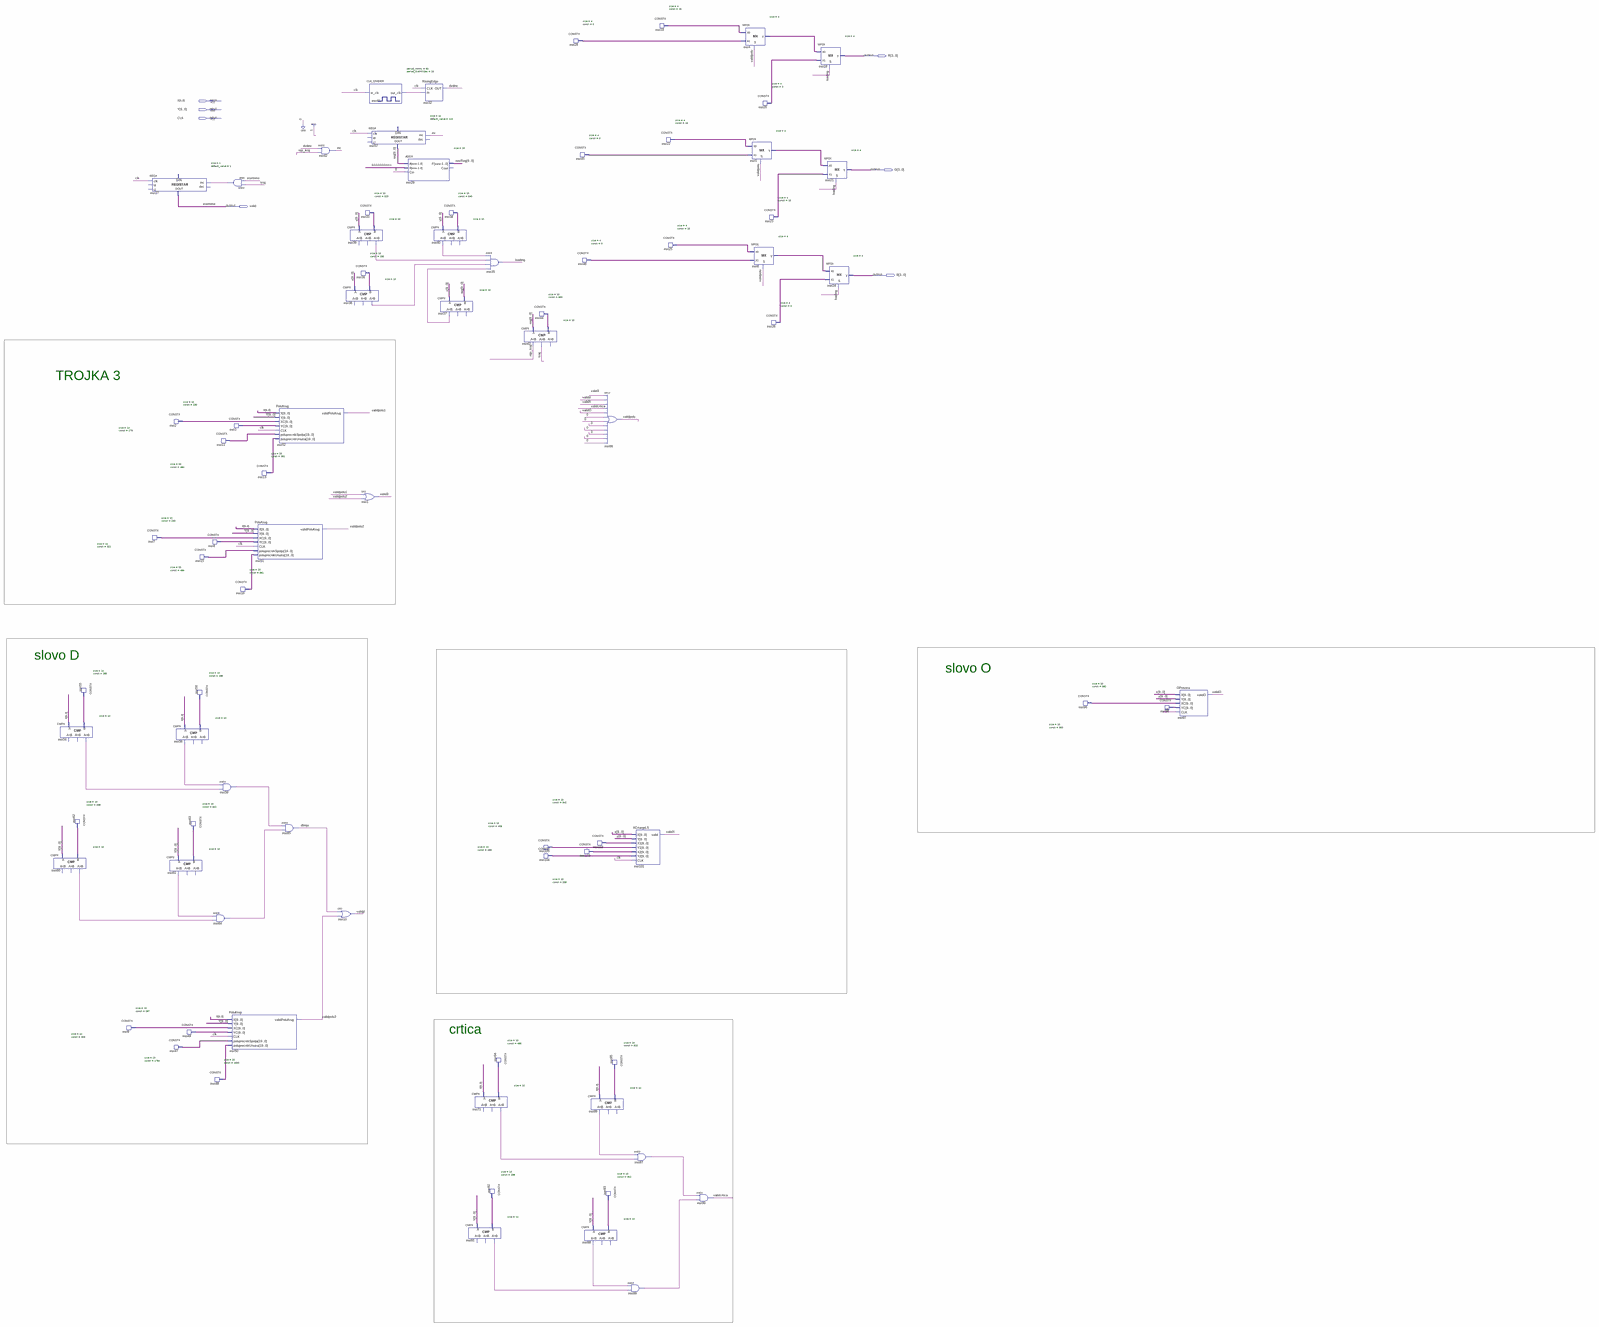
[diagram p0: schematic sheet, whole]
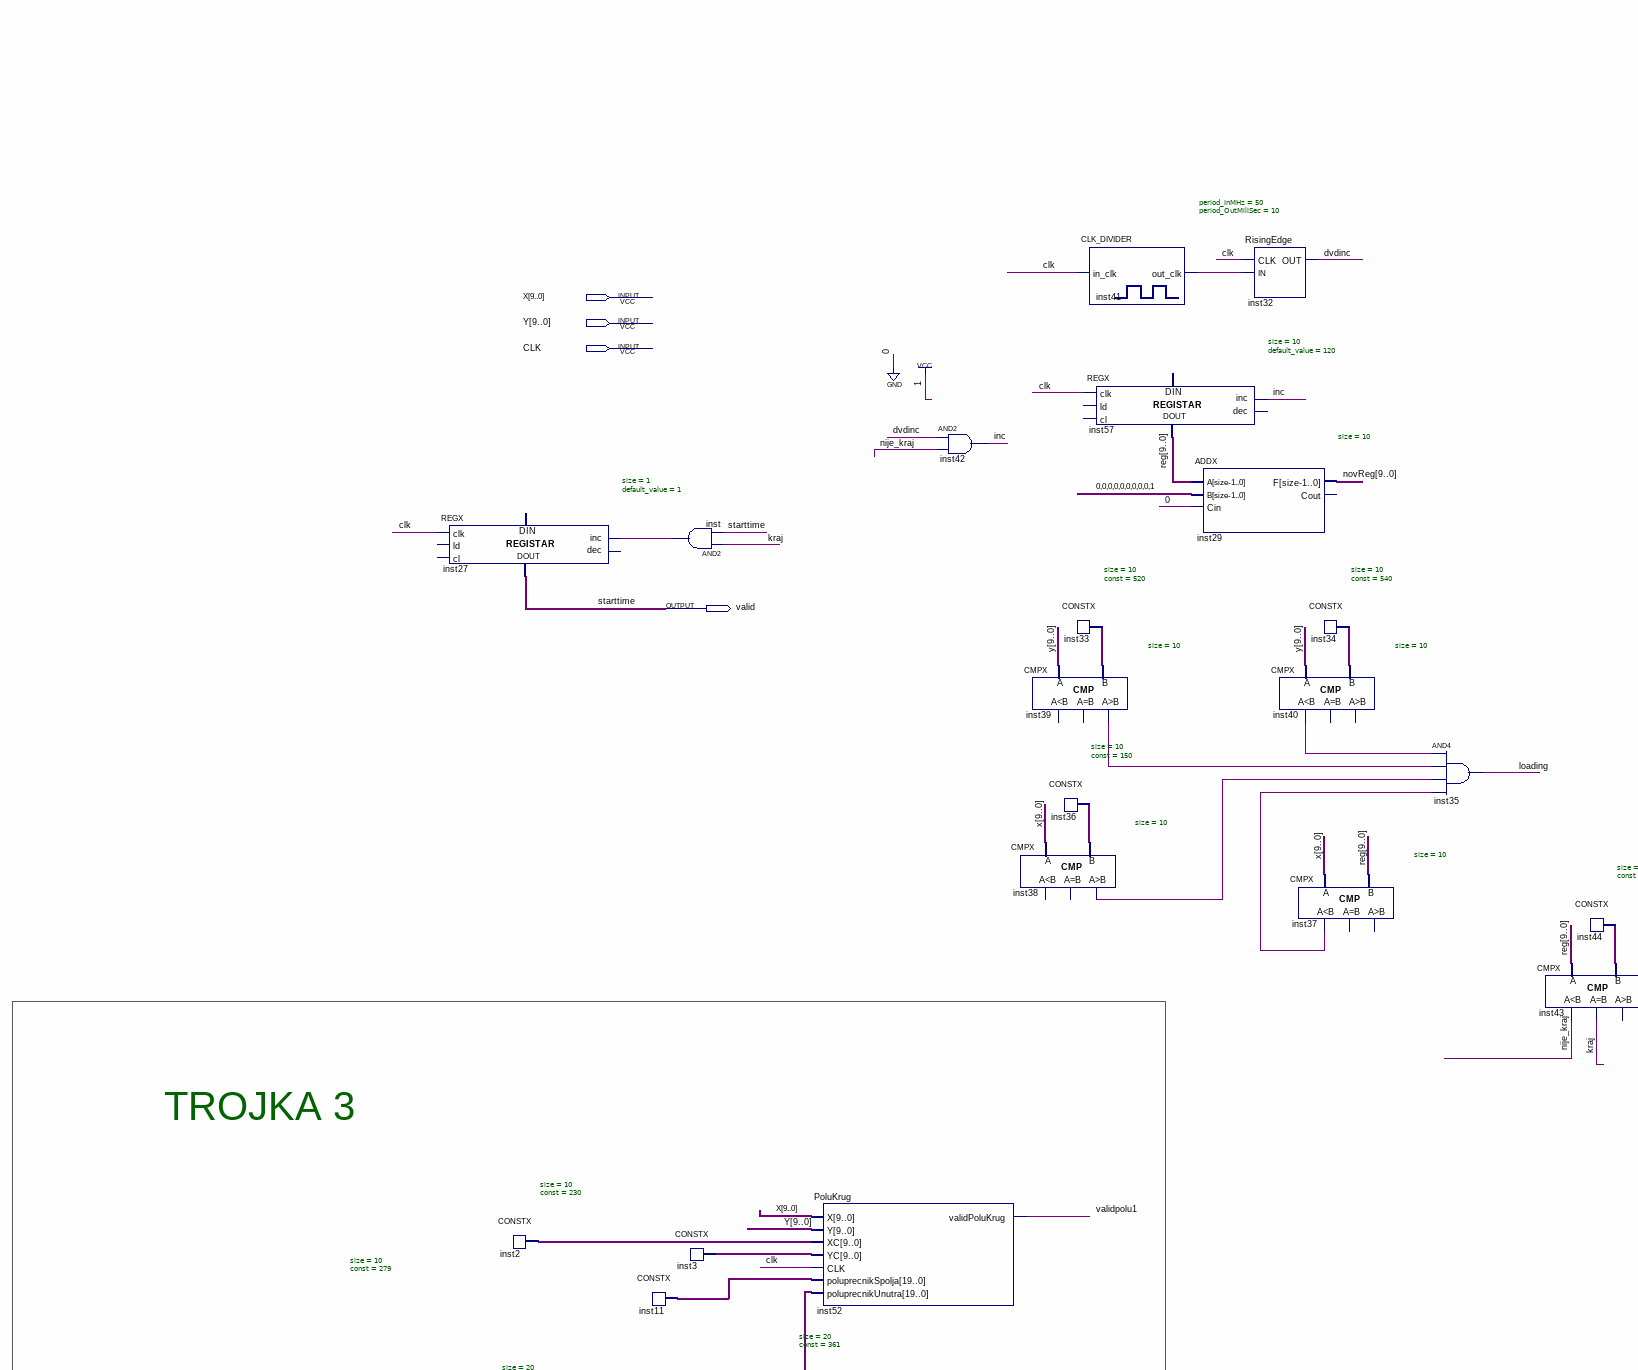
[diagram p1: schematic sheet, upper left part]
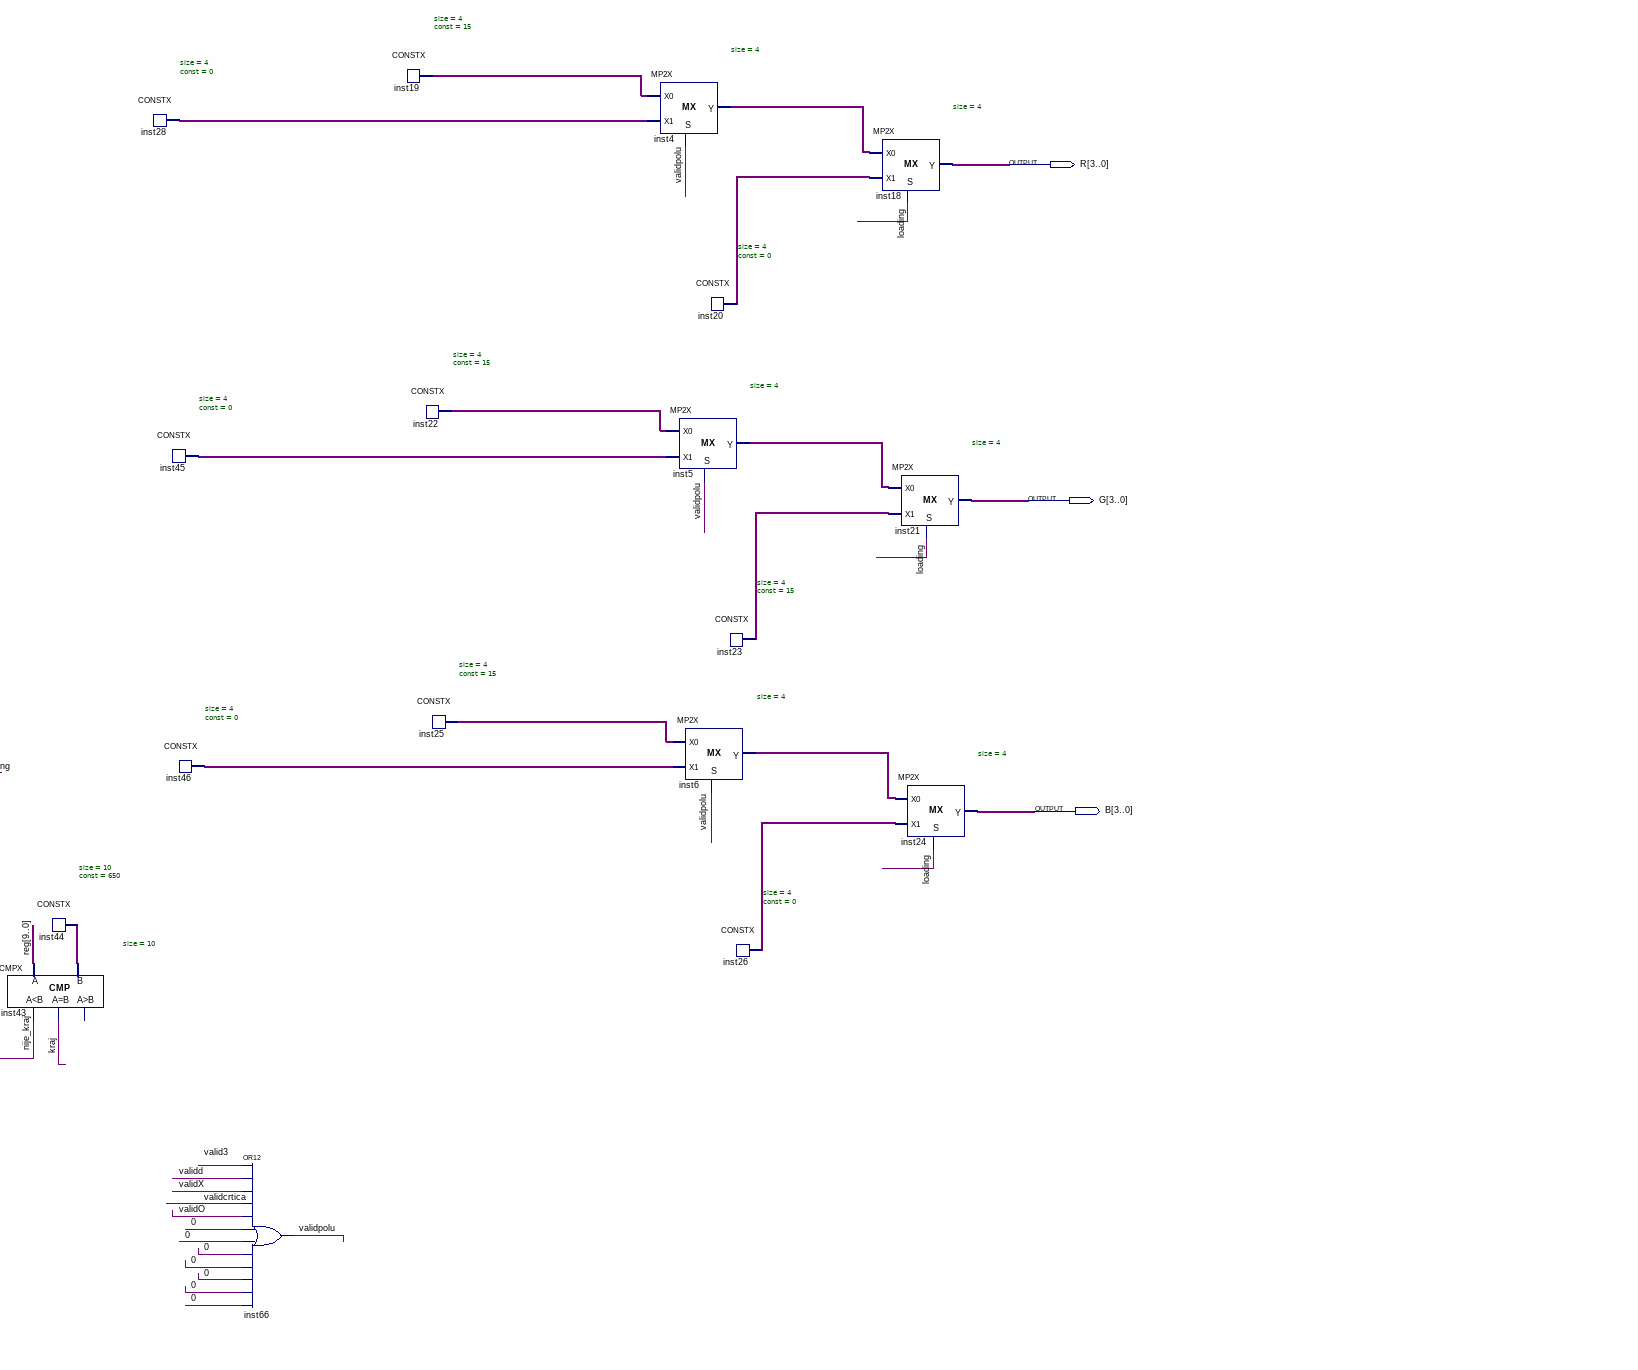
[diagram p2: schematic sheet, upper centre part]
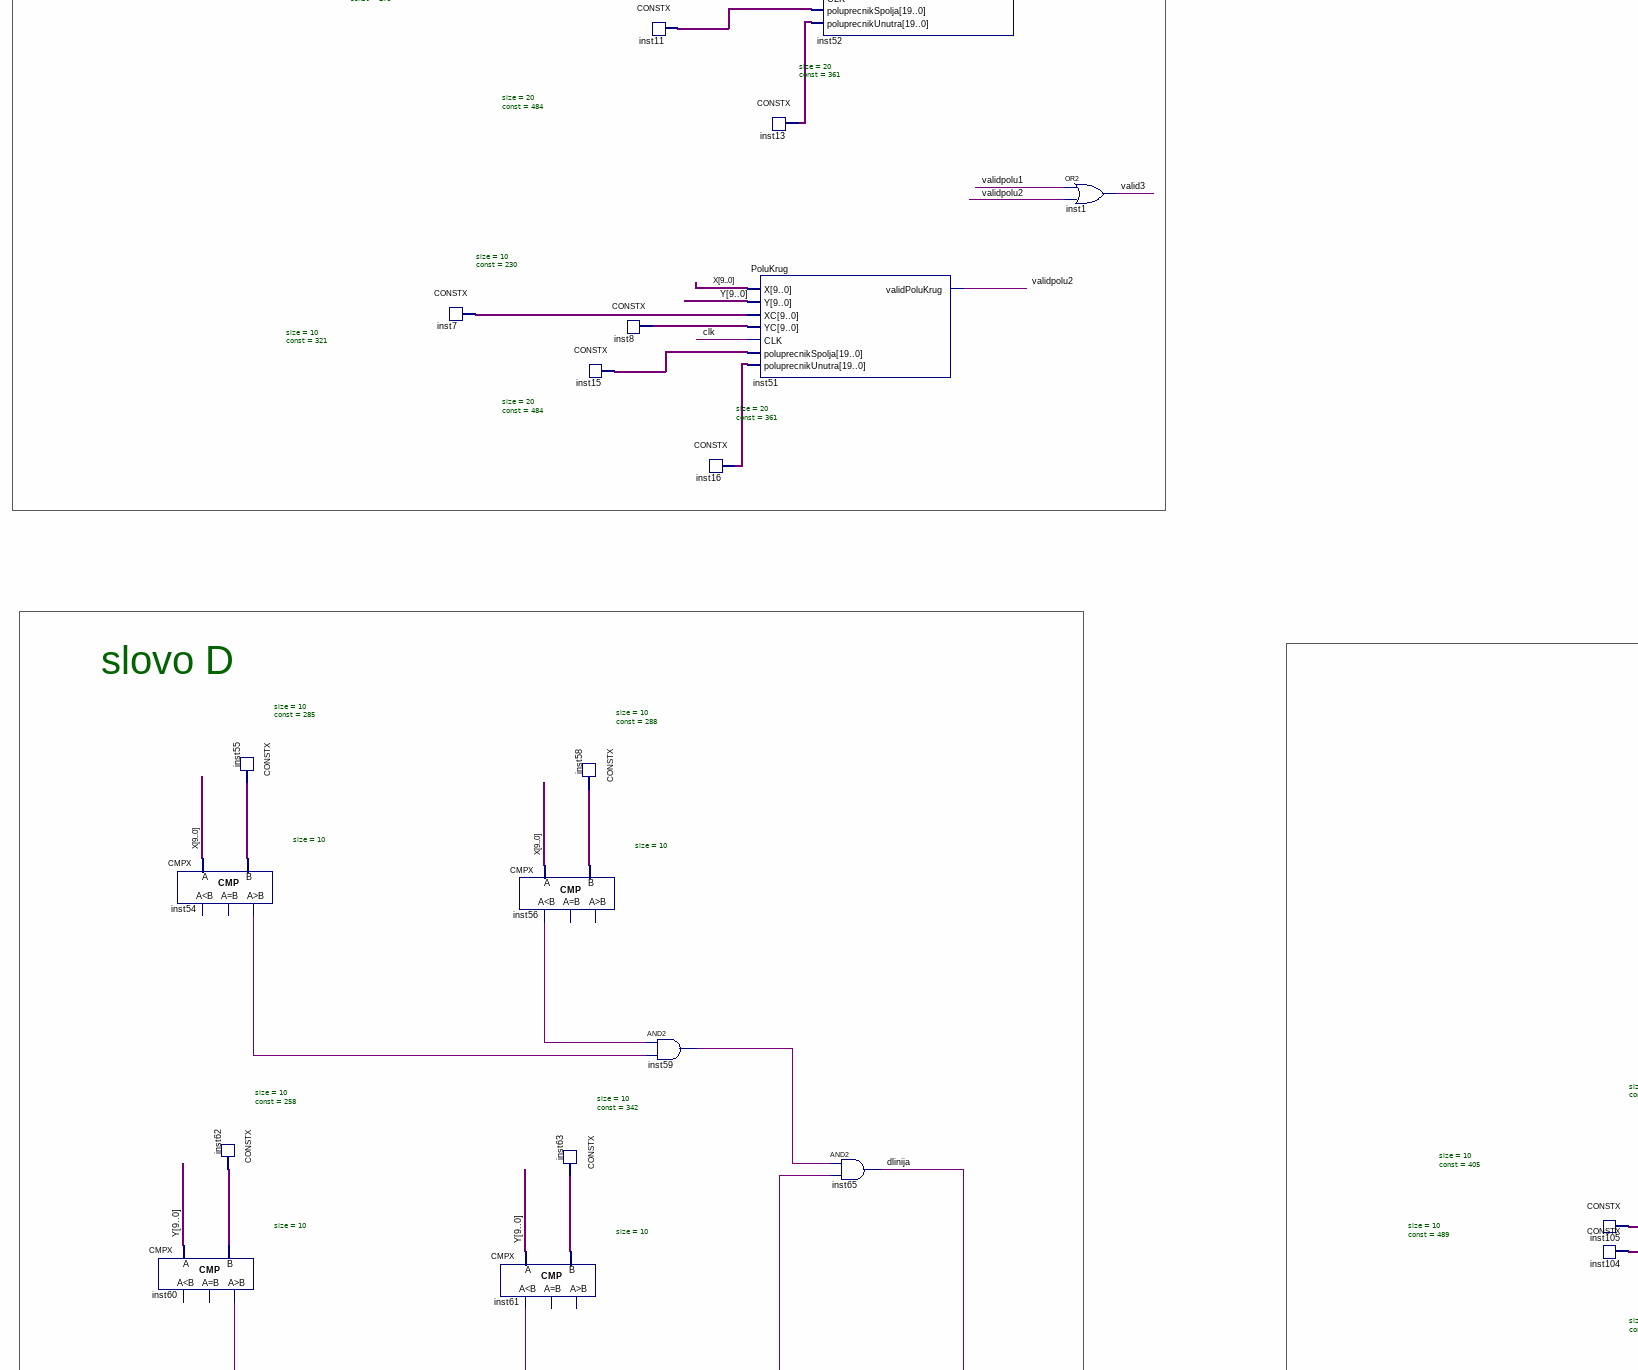
[diagram p3: schematic sheet, middle left part]
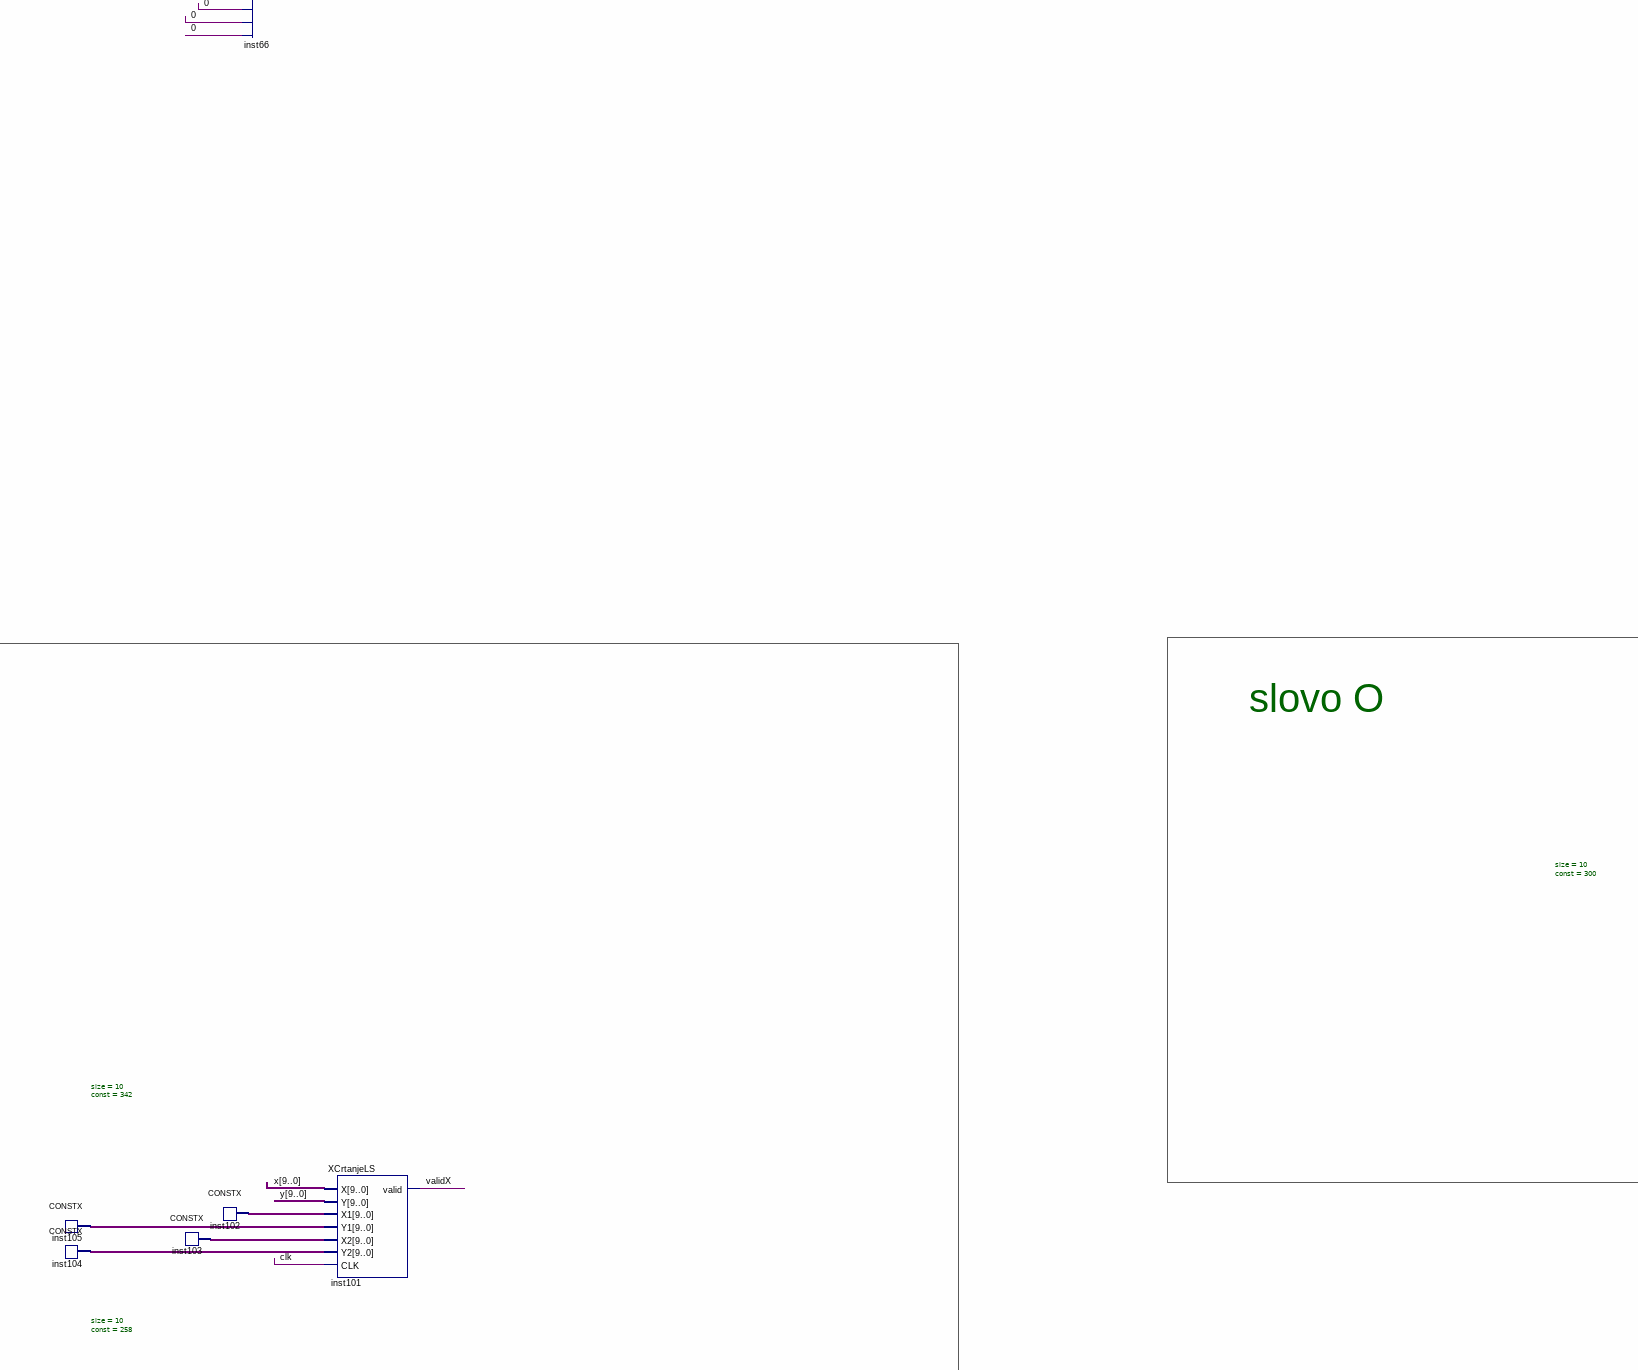
[diagram p4: schematic sheet, middle centre part]
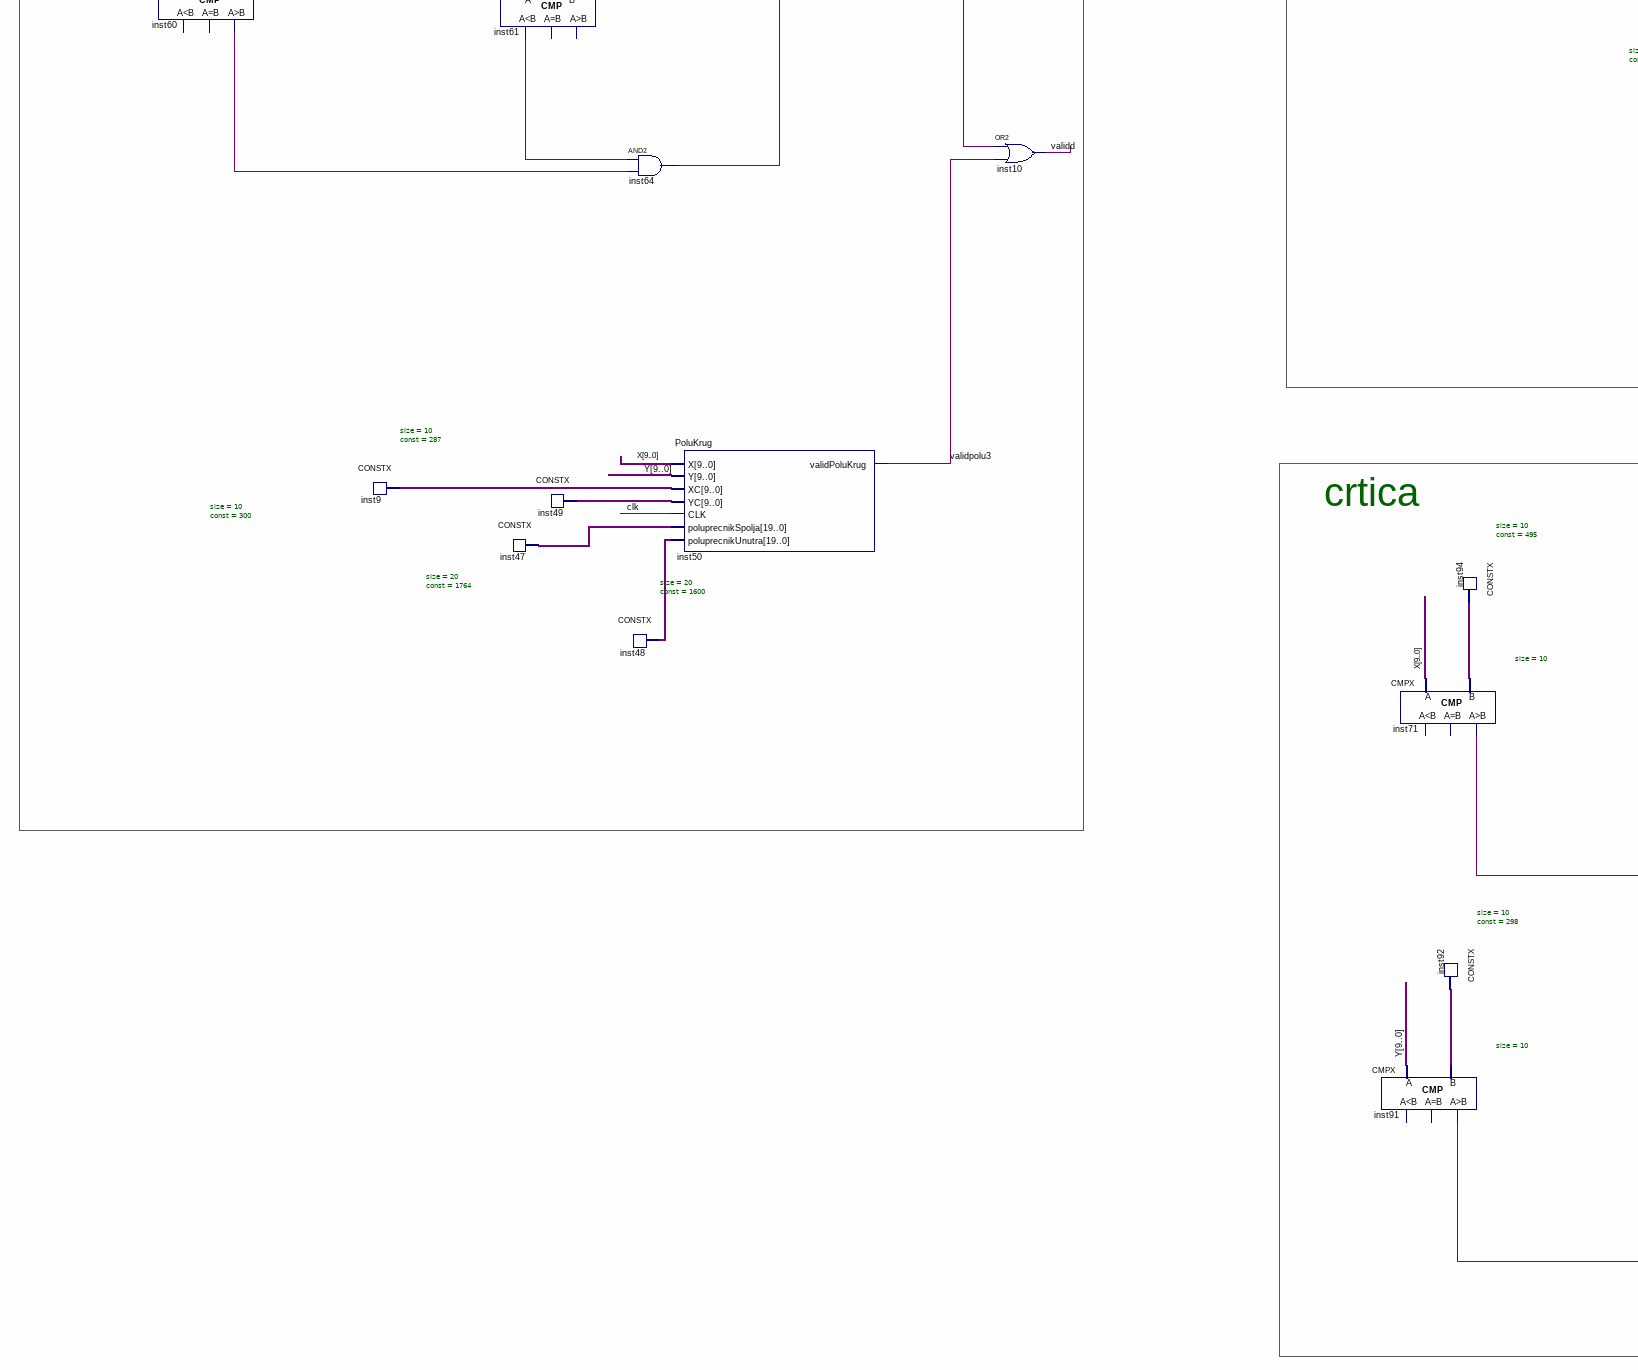
[diagram p5: schematic sheet, lower left part]
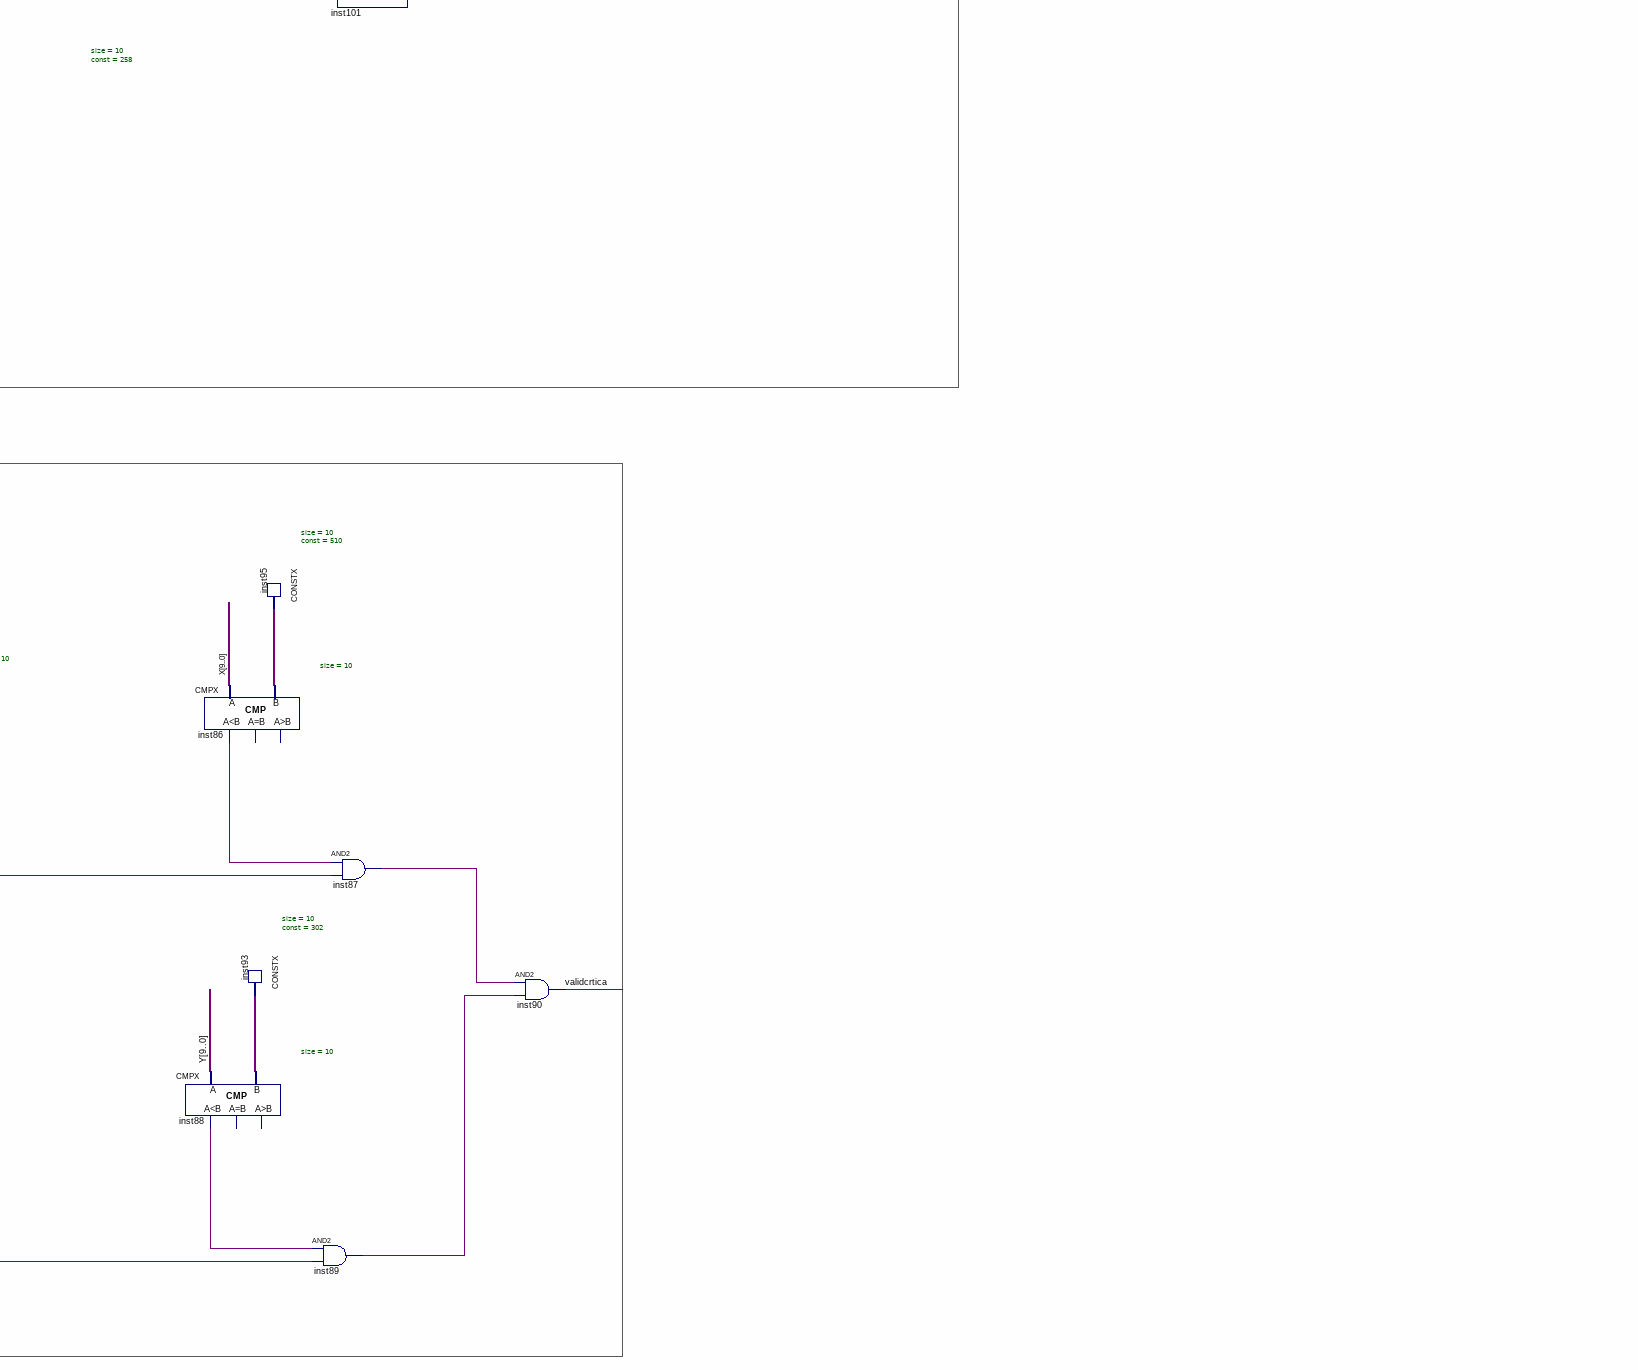
[diagram p6: schematic sheet, lower centre part]
// Quartus schematic LoadingScreen.bdf as structural Verilog: 80 symbols, 7 pins
module LoadingScreen (
  input  [9:0] X,
  input  [9:0] Y,
  input  CLK,
  output [3:0] R,
  output [3:0] G,
  output valid,
  output [3:0] B
);

  wire dlinija, dvdinc, inc, inst37_ls, inst38_gr, inst39_gr, inst40_ls, inst41_out_clk, inst54_gr,
       inst56_ls, inst59_out, inst60_gr, inst61_ls, inst64_out, inst71_gr, inst86_ls, inst87_out, inst88_ls,
       inst89_out, inst91_gr, inst_out, kraj, loading, nije_kraj, valid3, validcrtica, validd, validO,
       validpolu, validpolu1, validpolu2, validpolu3, validX;
  wire [3:0] inst4_y, inst5_y, inst6_y, inst19_data, inst20_data, inst22_data, inst23_data, inst25_data,
       inst26_data, inst28_data, inst45_data, inst46_data;
  wire [9:0] inst2_data, inst3_data, inst7_data, inst8_data, inst9_data, inst33_data, inst34_data,
       inst36_data, inst44_data, inst49_data, inst55_data, inst58_data, inst62_data, inst63_data,
       inst92_data, inst93_data, inst94_data, inst95_data, inst96_data, inst98_data, inst102_data,
       inst103_data, inst104_data, inst105_data, novReg, \reg ;
  wire [19:0] inst11_data, inst13_data, inst15_data, inst16_data, inst47_data, inst48_data;

  CMPX #(.size(10)) inst60 (.A(Y), .B(inst62_data), .gr(inst60_gr));  // open: ls, eq
  CMPX #(.size(10)) inst54 (.A(X), .B(inst55_data), .gr(inst54_gr));  // open: ls, eq
  CONSTX #(.size(10), .\const (285)) inst55 (.data(inst55_data));
  CONSTX #(.size(10), .\const (258)) inst62 (.data(inst62_data));
  CONSTX #(.size(10), .\const (287)) inst9 (.data(inst9_data));
  REGX #(.size(1), .default_value(1)) inst27 (
    .clk(CLK), .inc(inst_out), .data_out(valid));  // open: ld, cl, dec, data_in
  CONSTX #(.size(10), .\const (230)) inst7 (.data(inst7_data));
  CONSTX #(.size(10), .\const (230)) inst2 (.data(inst2_data));
  CMPX #(.size(10)) inst56 (.A(X), .B(inst58_data), .ls(inst56_ls));  // open: eq, gr
  CMPX #(.size(10)) inst61 (.A(Y), .B(inst63_data), .ls(inst61_ls));  // open: eq, gr
  CONSTX #(.size(20), .\const (1764)) inst47 (.data(inst47_data));
  CONSTX #(.size(10), .\const (342)) inst63 (.data(inst63_data));
  CONSTX #(.size(10), .\const (300)) inst49 (.data(inst49_data));
  CONSTX #(.size(10), .\const (321)) inst8 (.data(inst8_data));
  CONSTX #(.size(20), .\const (484)) inst15 (.data(inst15_data));
  CONSTX #(.size(10), .\const (288)) inst58 (.data(inst58_data));
  CONSTX #(.size(20), .\const (484)) inst11 (.data(inst11_data));
  and inst59 (inst59_out, inst56_ls, inst54_gr);
  and inst64 (inst64_out, inst61_ls, inst60_gr);
  CONSTX #(.size(20), .\const (1600)) inst48 (.data(inst48_data));
  and inst (inst_out, kraj, valid);
  CONSTX #(.size(10), .\const (279)) inst3 (.data(inst3_data));
  CONSTX #(.size(20), .\const (361)) inst16 (.data(inst16_data));
  PoluKrug inst50 (
    .X(X), .Y(Y), .XC(inst9_data), .YC(inst49_data), .CLK(CLK), .poluprecnikSpolja(inst47_data),
    .poluprecnikUnutra(inst48_data), .validPoluKrug(validpolu3));
  CONSTX #(.size(20), .\const (361)) inst13 (.data(inst13_data));
  PoluKrug inst51 (
    .X(X), .Y(Y), .XC(inst7_data), .YC(inst8_data), .CLK(CLK), .poluprecnikSpolja(inst15_data),
    .poluprecnikUnutra(inst16_data), .validPoluKrug(validpolu2));
  PoluKrug inst52 (
    .X(X), .Y(Y), .XC(inst2_data), .YC(inst3_data), .CLK(CLK), .poluprecnikSpolja(inst11_data),
    .poluprecnikUnutra(inst13_data), .validPoluKrug(validpolu1));
  and inst65 (dlinija, inst59_out, inst64_out);
  and inst42 (inc, dvdinc, nije_kraj);
  CMPX #(.size(10)) inst38 (.A(X), .B(inst36_data), .gr(inst38_gr));  // open: ls, eq
  or inst10 (validd, dlinija, validpolu3);
  CONSTX #(.size(10), .\const (520)) inst33 (.data(inst33_data));
  CMPX #(.size(10)) inst39 (.A(Y), .B(inst33_data), .gr(inst39_gr));  // open: ls, eq
  CONSTX #(.size(10), .\const (150)) inst36 (.data(inst36_data));
  or inst1 (valid3, validpolu1, validpolu2);
  CLK_DIVIDER #(.period_InMHz(50), .period_OutMiliSec(10)) inst41 (.in_clk(CLK), .out_clk(inst41_out_clk));
  REGX #(.size(10), .default_value(120)) inst57 (.clk(CLK), .inc(inc), .data_out(\reg ));  // open: ld, cl, dec, data_in
  ADDX #(.size(10)) inst29 (.A(\reg ), .B(10'b0000000001), .Cin(1'b0), .F(novReg));  // open: Cout
  RisingEdge inst32 (.CLK(CLK), .IN(inst41_out_clk), .OUT(dvdinc));
  CMPX #(.size(10)) inst40 (.A(Y), .B(inst34_data), .ls(inst40_ls));  // open: eq, gr
  CONSTX #(.size(10), .\const (540)) inst34 (.data(inst34_data));
  CMPX #(.size(10)) inst37 (.A(X), .B(\reg ), .ls(inst37_ls));  // open: eq, gr
  CMPX #(.size(10)) inst91 (.A(Y), .B(inst92_data), .gr(inst91_gr));  // open: ls, eq
  CMPX #(.size(10)) inst71 (.A(X), .B(inst94_data), .gr(inst71_gr));  // open: ls, eq
  and inst35 (loading, inst40_ls, inst39_gr, inst38_gr, inst37_ls);
  CONSTX #(.size(10), .\const (495)) inst94 (.data(inst94_data));
  CONSTX #(.size(10), .\const (298)) inst92 (.data(inst92_data));
  CONSTX #(.size(10), .\const (650)) inst44 (.data(inst44_data));
  CMPX #(.size(10)) inst43 (.A(\reg ), .B(inst44_data), .ls(nije_kraj), .eq(kraj));  // open: gr
  CONSTX #(.size(10), .\const (258)) inst105 (.data(inst105_data));
  CONSTX #(.size(10), .\const (342)) inst104 (.data(inst104_data));
  CONSTX #(.size(4), .\const (0)) inst28 (.data(inst28_data));
  CONSTX #(.size(4), .\const (0)) inst45 (.data(inst45_data));
  CONSTX #(.size(4), .\const (0)) inst46 (.data(inst46_data));
  CONSTX #(.size(10), .\const (489)) inst103 (.data(inst103_data));
  CMPX #(.size(10)) inst88 (.A(Y), .B(inst93_data), .ls(inst88_ls));  // open: eq, gr
  CONSTX #(.size(10), .\const (405)) inst102 (.data(inst102_data));
  CMPX #(.size(10)) inst86 (.A(X), .B(inst95_data), .ls(inst86_ls));  // open: eq, gr
  CONSTX #(.size(10), .\const (302)) inst93 (.data(inst93_data));
  or inst66 (validpolu, valid3, validd, validX, validcrtica, validO, 1'b0, 1'b0, 1'b0, 1'b0, 1'b0, 1'b0, 1'b0);
  CONSTX #(.size(10), .\const (510)) inst95 (.data(inst95_data));
  XCrtanjeLS inst101 (
    .X(X), .Y(Y), .X1(inst102_data), .Y1(inst105_data), .X2(inst103_data), .Y2(inst104_data), .CLK(CLK),
    .valid(validX));
  and inst87 (inst87_out, inst86_ls, inst71_gr);
  and inst89 (inst89_out, inst88_ls, inst91_gr);
  CONSTX #(.size(4), .\const (15)) inst19 (.data(inst19_data));
  CONSTX #(.size(4), .\const (15)) inst22 (.data(inst22_data));
  CONSTX #(.size(4), .\const (15)) inst25 (.data(inst25_data));
  and inst90 (validcrtica, inst87_out, inst89_out);
  MP2X #(.size(4)) inst4 (.S(validpolu), .X0(inst19_data), .X1(inst28_data), .Y(inst4_y));
  CONSTX #(.size(4), .\const (0)) inst20 (.data(inst20_data));
  MP2X #(.size(4)) inst5 (.S(validpolu), .X0(inst22_data), .X1(inst45_data), .Y(inst5_y));
  MP2X #(.size(4)) inst6 (.S(validpolu), .X0(inst25_data), .X1(inst46_data), .Y(inst6_y));
  CONSTX #(.size(4), .\const (15)) inst23 (.data(inst23_data));
  CONSTX #(.size(4), .\const (0)) inst26 (.data(inst26_data));
  MP2X #(.size(4)) inst18 (.S(loading), .X0(inst4_y), .X1(inst20_data), .Y(R));
  MP2X #(.size(4)) inst21 (.S(loading), .X0(inst5_y), .X1(inst23_data), .Y(G));
  MP2X #(.size(4)) inst24 (.S(loading), .X0(inst6_y), .X1(inst26_data), .Y(B));
  CONSTX #(.size(10), .\const (562)) inst96 (.data(inst96_data));
  CONSTX #(.size(10), .\const (300)) inst98 (.data(inst98_data));
  OProvera inst97 (.X(X), .Y(Y), .XC(inst96_data), .YC(inst98_data), .CLK(CLK), .validO(validO));

  // Other names for the same wires on the sheet: starttime = valid

  // Notes on the sheet:
  //   TROJKA 3
  //   slovo D
  //   slovo O
  //   crtica
endmodule
